# EAGLE schematic Node_4Send (EAGLE 7.3.0)
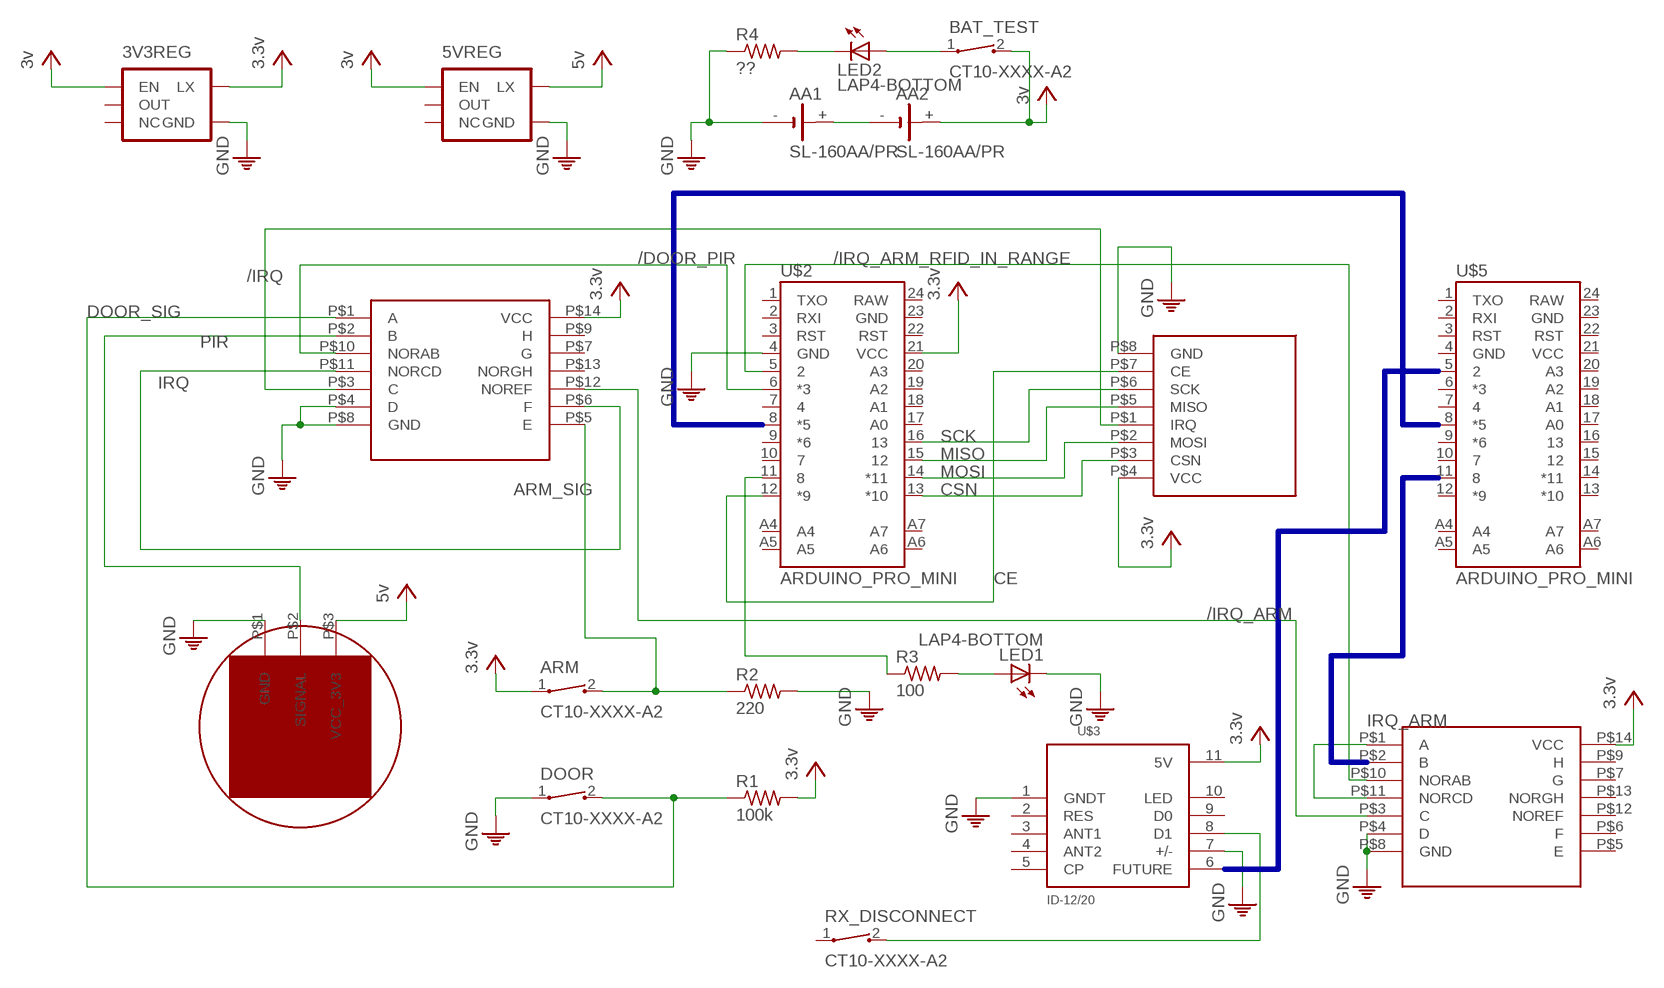
[diagram p0: schematic, sheet 1]

## Parts
3V3REG  V_REG_NCP1400SOT23-5  [SOT23-5]
5VREG  V_REG_NCP1400SOT23-5  [SOT23-5]
AA1  SL-160AA/PR  [SL-160AA/PR]
AA2  SL-160AA/PR  [SL-160AA/PR]
ARM  CT10-XXXX-A2  [CT10-XXXX-A2]
BAT_TEST  CT10-XXXX-A2  [CT10-XXXX-A2]
DOOR  CT10-XXXX-A2  [CT10-XXXX-A2]
LED1  LAP4-BOTTOM  [P47F-BOTTOM]
LED2  LAP4-BOTTOM  [P47F-BOTTOM]
NRF_MODULE  NRF24L01  [NRF24L01]
R1  100k  R-US_0204/5  [0204/5]
R2  220  R-US_0204/5  [0204/5]
R3  100  R-US_0204/5  [0204/5]
R4  ??  R-US_0204/5  [0204/5]
RX_DISCONNECT  CT10-XXXX-A2  [CT10-XXXX-A2]
U$1  PIR_MOTION_SENSOR  [3OUT]
U$2  ARDUINO_PRO_MINI  [ARDUINO_PRO_MINI]
U$3  ID-12/20  [ID-12]
U$4  TI_CD4001BE  [14DIP]
U$5  ARDUINO_PRO_MINI  [ARDUINO_PRO_MINI]
U$6  TI_CD4001BE  [14DIP]

## Nets
/DOOR_PIR: U$2.6(*3) U$4.P$10(NORAB)
/IRQ: NRF_MODULE.P$1(IRQ) U$4.P$3(C)
/IRQ_ARM: U$4.P$12(NOREF) U$6.P$3(C)
/IRQ_ARM_RFID_IN_RANGE: U$2.5 U$6.P$10(NORAB)
ARM_SIG: ARM.2 R2.1 U$4.P$5(E)
CE: NRF_MODULE.P$7(CE) U$2.12(*9)
CSN: NRF_MODULE.P$3(CSN) U$2.13(*10)
DOOR_SIG: DOOR.2 R1.1 U$4.P$1(A)
IRQ: U$4.P$6(F) U$4.P$11(NORCD)
IRQ_ARM: U$6.P$1(A) U$6.P$11(NORCD)
MISO: NRF_MODULE.P$5(MISO) U$2.15
MOSI: NRF_MODULE.P$2(MOSI) U$2.14(*11)
N$1: AA1.+ AA2.-
N$2: LED2.C R4.2
N$3: R3.1 U$2.11
N$4: BAT_TEST.1 LED2.A
N$5: LED1.A R3.2
N$6: RX_DISCONNECT.2 U$3.8(D1)
PE: 3V3REG.4(GND) 5VREG.4(GND) AA1.- DOOR.1 LED1.C NRF_MODULE.P$8(GND) R2.2 R4.1 U$1.P$1(GND) U$2.4(GND) U$3.1(GNDT) U$3.7(+/-) U$4.P$4(D) U$4.P$8(GND) U$6.P$4(D) U$6.P$8(GND) ; supply symbol labelled GND
PIR: U$1.P$2(SIGNAL) U$4.P$2(B)
SCK: NRF_MODULE.P$6(SCK) U$2.16
VCC: 3V3REG.1(EN) 3V3REG.5(LX) 5VREG.1(EN) 5VREG.5(LX) AA2.+ ARM.1 BAT_TEST.2 NRF_MODULE.P$4(VCC) R1.2 U$1.P$3(VCC_3V3) U$2.21(VCC) U$3.11(5V) U$4.P$14(VCC) U$6.P$14(VCC) ; supply symbol labelled 3v, 3.3v, 5v
Unconnected: 3V3REG.2(OUT) 3V3REG.3(NC) 5VREG.2(OUT) 5VREG.3(NC) RX_DISCONNECT.1 U$2.1(TXO) U$2.2(RXI) U$2.3(RST) U$2.7 U$2.8(*5) U$2.9(*6) U$2.10 U$2.17(A0) U$2.18(A1) U$2.19(A2) U$2.20(A3) U$2.22(RST) U$2.23(GND) U$2.24(RAW) U$2.A4 U$2.A5 U$2.A6 U$2.A7 U$3.2(RES) U$3.3(ANT1) U$3.4(ANT2) U$3.5(CP) U$3.6(FUTURE) U$3.9(D0) U$3.10(LED) U$4.P$7(G) U$4.P$9(H) U$4.P$13(NORGH) U$5.1(TXO) U$5.2(RXI) U$5.3(RST) U$5.4(GND) U$5.5 U$5.6(*3) U$5.7 U$5.8(*5) U$5.9(*6) U$5.10 U$5.11 U$5.12(*9) U$5.13(*10) U$5.14(*11) U$5.15 U$5.16 U$5.17(A0) U$5.18(A1) U$5.19(A2) U$5.20(A3) U$5.21(VCC) U$5.22(RST) U$5.23(GND) U$5.24(RAW) U$5.A4 U$5.A5 U$5.A6 U$5.A7 U$6.P$2(B) U$6.P$5(E) U$6.P$6(F) U$6.P$7(G) U$6.P$9(H) U$6.P$12(NOREF) U$6.P$13(NORGH)

## Buses
B$1
B$2
B$3

## Library data of the parts
3V3REG 5VREG = SparkFun-PowerIC:V_REG_NCP1400: Switching step-up voltage regulator NCP1400 switiching regulator takes single cell AA and outputs 100mA at 3.3V or 5V with minimal number of external components.
AA1 AA2 = battery:SL-160AA/PR: LI BATTERY Sonnenschein
ARM BAT_TEST DOOR RX_DISCONNECT = switch-coto:CT10-XXXX-: CT10 Series Molded Switch Source: www.cotorelay.com .. Coto_Technology__CT10-1530-G1.pdf
LED1 LED2 = led:*P4: PointLED® Enhanced Thinfilm LED TOP & BOTTOM mount LS P47F, LR P47F, LA P47F, LY P47F, LT P4SG, LB P4SG, LW P4SG Source: http://catalog.osram-os.com .. LA_LR_LS_LY_P47F_Pb_free.pdf
NRF_MODULE = max parts:NRF24L01
R1-R4 = resistor:R-US_: RESISTOR, American symbol
U$1 = max parts:PIR_MOTION_SENSOR
U$2 U$5 = SparkFun-Boards:ARDUINO_PRO_MINI
U$3 = SparkFun-RF:ID-12/20: RFID reader for ID2, ID12, and ID20 Package
U$4 U$6 = max parts:TI_CD4001BE